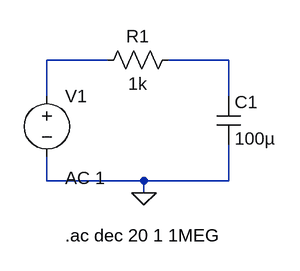
[diagram p0: schematic low-pass-filter-RC.asc]
low-pass-filter-RC.asc, the LTspice schematic file:
Version 4
SHEET 1 880 680
WIRE 160 96 80 96
WIRE 320 96 240 96
WIRE 80 144 80 96
WIRE 320 144 320 96
WIRE 80 256 80 224
WIRE 208 256 80 256
WIRE 320 256 320 208
WIRE 320 256 208 256
WIRE 208 272 208 256
FLAG 208 272 0
SYMBOL res 256 80 R90
WINDOW 0 0 56 VBottom 2
WINDOW 3 32 56 VTop 2
SYMATTR InstName R1
SYMATTR Value 1k
SYMBOL cap 304 144 R0
SYMATTR InstName C1
SYMATTR Value 100µ
SYMBOL voltage 80 128 R0
WINDOW 123 24 124 Left 2
WINDOW 39 0 0 Left 2
SYMATTR InstName V1
SYMATTR Value ""
SYMATTR Value2 AC 1
TEXT 104 328 Left 2 !.ac dec 20 1 1MEG

The netlist it stands for:
* low-pass-filter-RC.asc
R1 N002 N001 1k
C1 N002 0 100µ
V1 N001 0 AC 1
.ac dec 20 1 1MEG
.backanno
.end